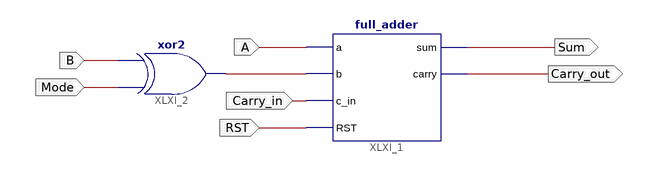
[diagram p0: schematic sheet 1]
// Xilinx ISE schematic control_adder_subtractor.sch (artix7) as structural Verilog: 2 symbols, 7 ports
module control_adder_subtractor (
  input  A,
  input  RST,
  input  B,
  input  Mode,
  input  Carry_in,
  output Sum,
  output Carry_out
);

  wire XLXN_2;

  full_adder XLXI_1 (.a(A), .b(XLXN_2), .carry(Carry_out), .c_in(Carry_in), .RST(RST), .sum(Sum));
  xor XLXI_2 (XLXN_2, Mode, B);
endmodule
